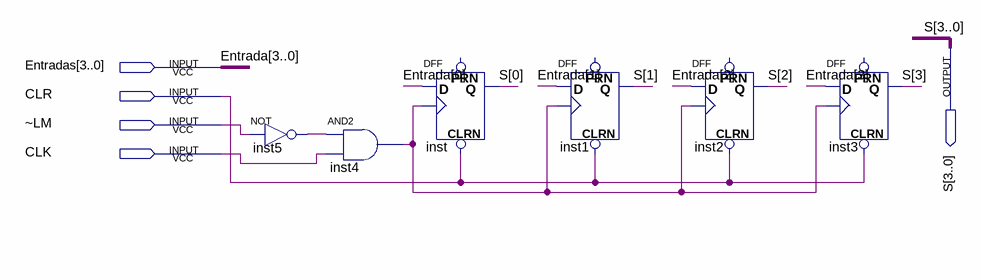
[diagram p0: schematic sheet]
// Quartus schematic REM.bdf as structural Verilog: 6 symbols, 5 pins
module REM (
  input  [3:0] Entradas,
  input  CLR,
  input  \~LM ,
  input  CLK,
  output [3:0] S
);

  wire inst4_out, inst5_out;

  not inst5 (inst5_out, \~LM );
  and inst4 (inst4_out, inst5_out, CLK);
  DFF inst (.CLRN(CLR), .CLK(inst4_out), .D(Entradas[0]), .Q(S[0]));  // open: PRN
  DFF inst1 (.CLRN(CLR), .CLK(inst4_out), .D(Entradas[1]), .Q(S[1]));  // open: PRN
  DFF inst2 (.CLRN(CLR), .CLK(inst4_out), .D(Entradas[2]), .Q(S[2]));  // open: PRN
  DFF inst3 (.CLRN(CLR), .CLK(inst4_out), .D(Entradas[3]), .Q(S[3]));  // open: PRN

  // Other names for the same wires on the sheet: Entrada[3:0] = Entradas
endmodule
